# EAGLE design 4ch constant current driver (EAGLE 7.7.0)
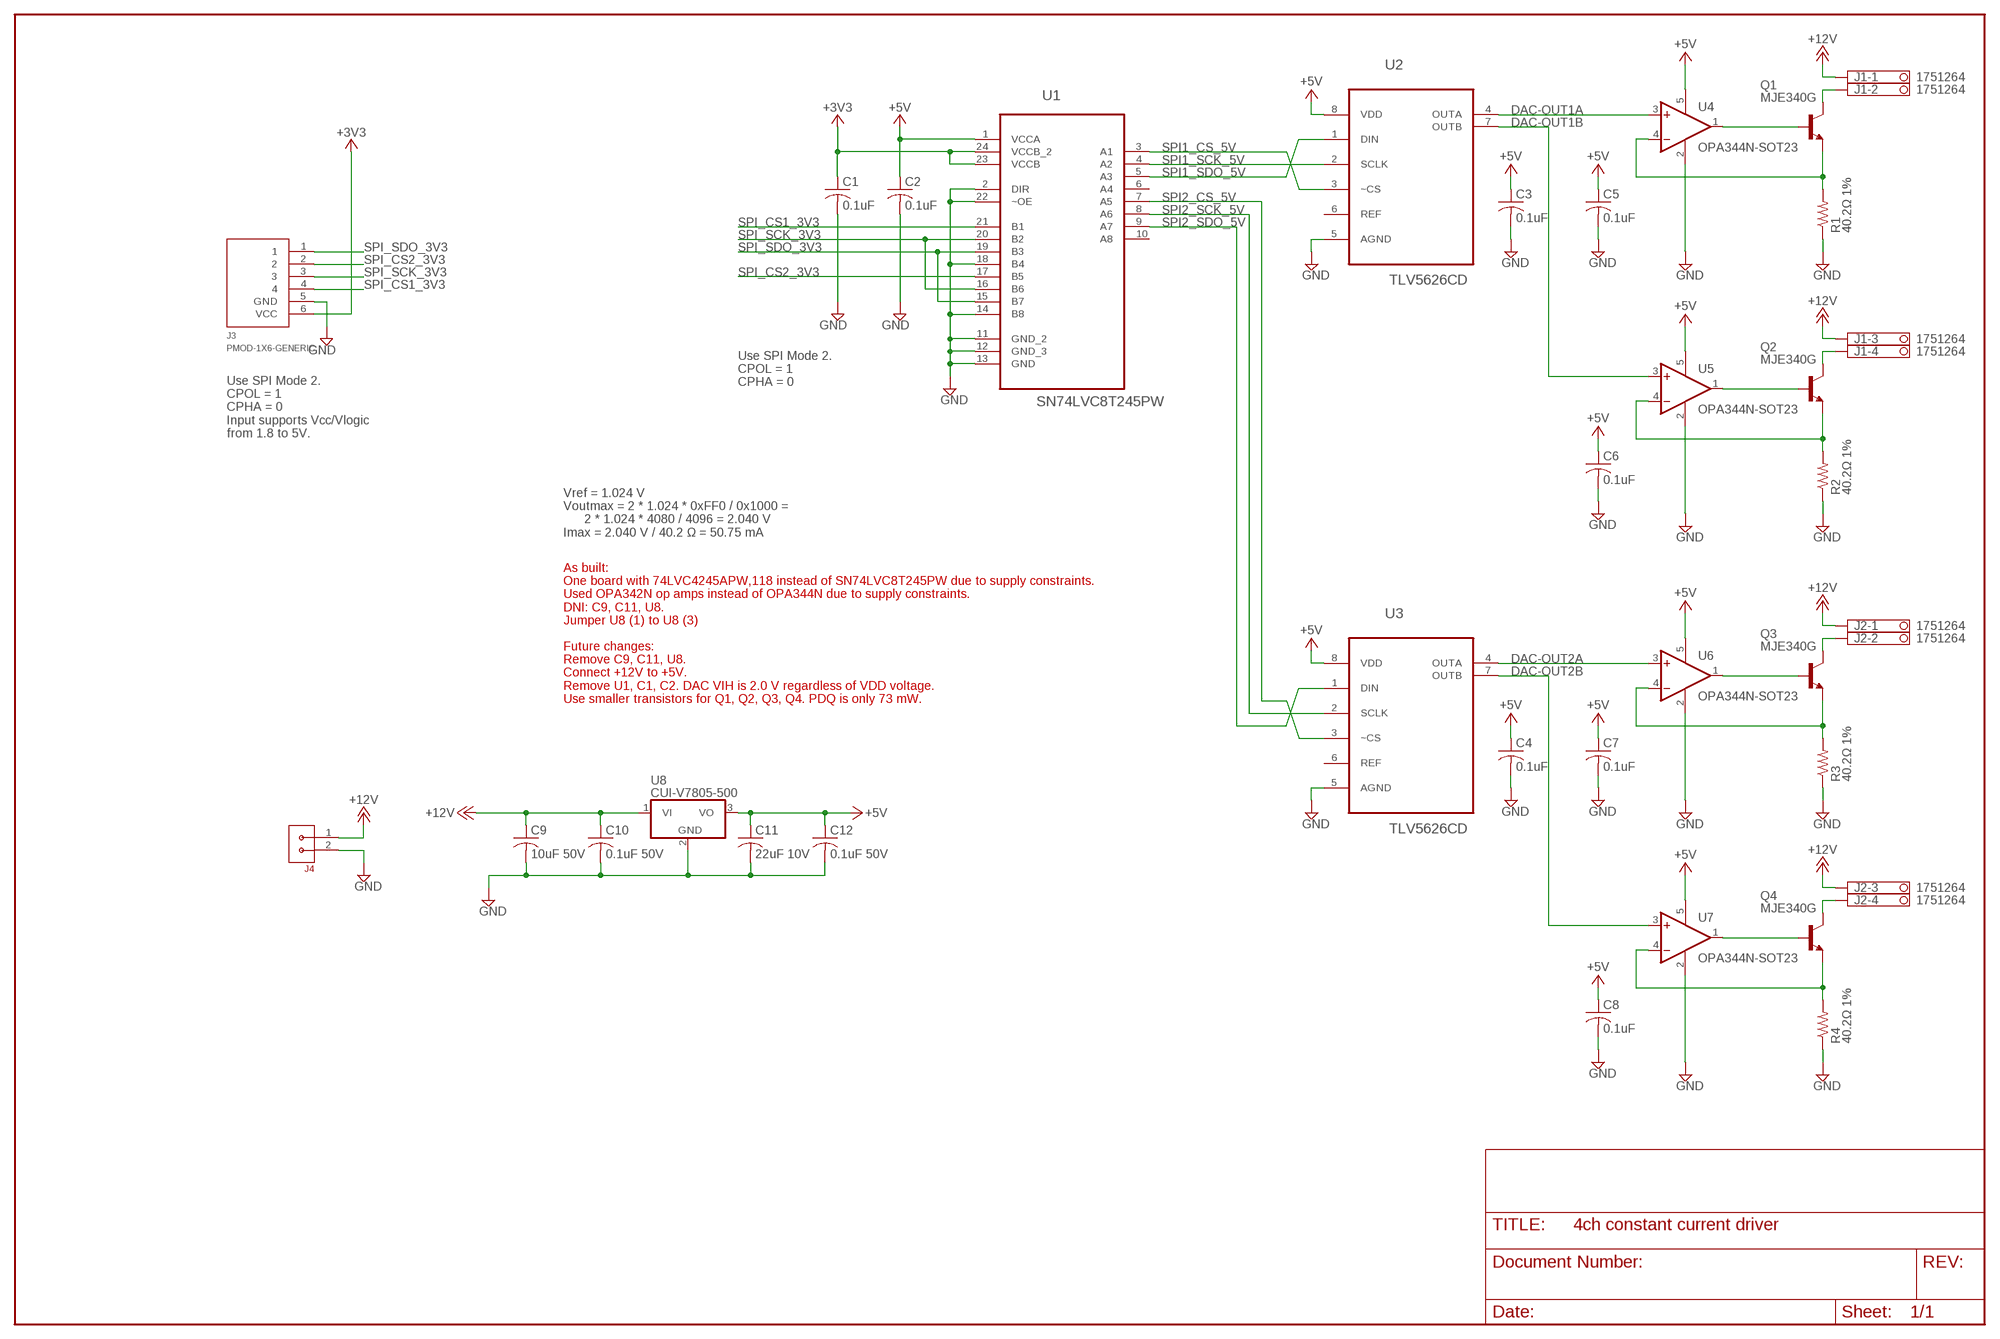
[diagram p0: schematic, sheet 1]

## Parts
C1  0.1uF  C-USC0603K  [C0603K]
C2  0.1uF  C-USC0603K  [C0603K]
C3  0.1uF  C-USC0603K  [C0603K]
C4  0.1uF  C-USC0603K  [C0603K]
C5  0.1uF  C-USC0603K  [C0603K]
C6  0.1uF  C-USC0603K  [C0603K]
C7  0.1uF  C-USC0603K  [C0603K]
C8  0.1uF  C-USC0603K  [C0603K]
C9  10uF 50V  C-USC1210K  [C1210K]
C10  0.1uF 50V  C-USC1206K  [C1206K]
C11  22uF 10V  C-USC1206K  [C1206K]
C12  0.1uF 50V  C-USC1206K  [C1206K]
J1  1751264  [1751264]
J2  1751264  [1751264]
J3  PMOD-1X6-GENERIC  [CON-PMOD-1X6]
J4  CON-3.81MM-1X2-PHOENIX  [CON-PHOENIX-3.81-1X2-RA]
Q1  MJE340G  -NPN-TO126V  [TO126V]
Q2  MJE340G  -NPN-TO126V  [TO126V]
Q3  MJE340G  -NPN-TO126V  [TO126V]
Q4  MJE340G  -NPN-TO126V  [TO126V]
R1  40.2Ω 1%  R-US_R1210  [R1210]
R2  40.2Ω 1%  R-US_R1210  [R1210]
R3  40.2Ω 1%  R-US_R1210  [R1210]
R4  40.2Ω 1%  R-US_R1210  [R1210]
U1  SN74LVC8T245PW  SN74AVC8T245PW  [SOP65P640X120-24N]
U2  TLV5626CD  [SOIC127P600X175-8N]
U3  TLV5626CD  [SOIC127P600X175-8N]
U4  OPA344N-SOT23  [SOT23-5]
U5  OPA344N-SOT23  [SOT23-5]
U6  OPA344N-SOT23  [SOT23-5]
U7  OPA344N-SOT23  [SOT23-5]
U8  CUI-V7805-500  CUI-V7803-500  [CUI-78XX-500]

## Nets
+3V3: C1.1 J3.6(VCC) U1.23(VCCB) U1.24(VCCB_2)
+5V: C2.1 C3.1 C4.1 C5.1 C6.1 C7.1 C8.1 C11.1 C12.1 U1.1(VCCA) U2.8(VDD) U3.8(VDD) U4.5(V+) U5.5(V+) U6.5(V+) U7.5(V+) U8.3(VO)
+12V: C9.1 C10.1 J1.1 J1.3 J2.1 J2.3 J4.1 U8.1(VI)
DAC-OUT1A: U2.4(OUTA) U4.3(+IN)
DAC-OUT1B: U2.7(OUTB) U5.3(+IN)
DAC-OUT2A: U3.4(OUTA) U6.3(+IN)
DAC-OUT2B: U3.7(OUTB) U7.3(+IN)
GND: C1.2 C2.2 C3.2 C4.2 C5.2 C6.2 C7.2 C8.2 C9.2 C10.2 C11.2 C12.2 J3.5(GND) J4.2 R1.1 R2.1 R3.1 R4.1 U1.2(DIR) U1.11(GND_2) U1.12(GND_3) U1.13(GND) U1.14(B8) U1.18(B4) U1.22(~OE) U2.5(AGND) U3.5(AGND) U4.2(V-) U5.2(V-) U6.2(V-) U7.2(V-) U8.2(GND)
N$1: Q1.1(E) R1.2 U4.4(-IN)
N$2: Q3.1(E) R3.2 U6.4(-IN)
N$3: Q1.3(B) U4.1(OUT)
N$4: Q3.3(B) U6.1(OUT)
N$5: Q4.1(E) R4.2 U7.4(-IN)
N$6: Q4.3(B) U7.1(OUT)
N$10: Q2.1(E) R2.2 U5.4(-IN)
N$12: Q2.3(B) U5.1(OUT)
OUT1A: J1.2 Q1.2(C)
OUT1B: J1.4 Q2.2(C)
OUT2A: J2.2 Q3.2(C)
OUT2B: J2.4 Q4.2(C)
SPI1_CS_5V: U1.3(A1) U2.3(~CS)
SPI1_SCK_5V: U1.4(A2) U2.2(SCLK)
SPI1_SDO_5V: U1.5(A3) U2.1(DIN)
SPI2_CS_5V: U1.7(A5) U3.3(~CS)
SPI2_SCK_5V: U1.8(A6) U3.2(SCLK)
SPI2_SDO_5V: U1.9(A7) U3.1(DIN)
SPI_CS1_3V3: J3.4 U1.21(B1)
SPI_CS2_3V3: J3.2 U1.17(B5)
SPI_SCK_3V3: J3.3 U1.16(B6) U1.20(B2)
SPI_SDO_3V3: J3.1 U1.15(B7) U1.19(B3)
Unconnected: U1.6(A4) U1.10(A8) U2.6(REF) U3.6(REF)

## Notes on the sheet
- Use SPI Mode 2.
  CPOL = 1
  CPHA = 0
- Use SPI Mode 2.
  CPOL = 1
  CPHA = 0
  Input supports Vcc/Vlogic
  from 1.8 to 5V.
- Vref = 1.024 V
  Voutmax = 2 * 1.024 * 0xFF0 / 0x1000 = 
        2 * 1.024 * 4080 / 4096 = 2.040 V
  Imax = 2.040 V / 40.2 Ω = 50.75 mA
- As built:
  One board with 74LVC4245APW,118 instead of SN74LVC8T245PW due to supply constraints.
  Used OPA342N op amps instead of OPA344N due to supply constraints.
  DNI: C9, C11, U8.
  Jumper U8 (1) to U8 (3)
  
  Future changes:
  Remove C9, C11, U8.
  Connect +12V to +5V.
  Remove U1, C1, C2. DAC VIH is 2.0 V regardless of VDD voltage.
  Use smaller transistors for Q1, Q2, Q3, Q4. PDQ is only 73 mW.

## Library data of the parts
C1-C8 = rcl:C-US: CAPACITOR, American symbol; MFR: KEMET; MFR_PART_NO: C1206C104K5RACAUTO
C9 = rcl:C-US: CAPACITOR, American symbol; MFR: KEMET; MFR_PART_NO: C1210C106K5RACTU
C10 C12 = rcl:C-US: CAPACITOR, American symbol; MFR: KEMET; MFR_PART_NO: C1206S104M5RACTU
C11 = rcl:C-US: CAPACITOR, American symbol; MFR: KEMET; MFR_PART_NO: C1206C226K8RAC7800
J1 J2 = con-phoenix-350:1751264: MKDS 1/ 4-3,5 Printklemme Nennstrom: 10 A Bemessungsspannung: 160 V Raster: 3,5 mm Polzahl: 4 Montageart: Löten Anschlussart: Schraubanschluss Anschlussrichtung vom Leiter zur Platine: 0° Source: http://eshop.phoenixcontact.com .. 1751264.pdf; MPN: 1751264; OC_FARNELL: unknown; OC_NEWARK: 10R0934
J3 = 0GlenConnectors:PMOD-1X6-GENERIC
J4 = 0GlenConnectors:CON-3.81MM-1X2-PHOENIX
Q1-Q4 = transistor:*-NPN-: NPN Transistror BF959 corrected 2008.03.06; MFR: ON SEMI; MFR_PART_NO: MJE340G
R1-R4 = rcl:R-US_: RESISTOR, American symbol; MFR: PANASONIC; MFR_PART_NO: ERJ-14NF73R2U
U1 = Texas Instruments_By_element14_Batch_1:SN74AVC8T245PW: TRANSCEIVER; MFR: TI; MFR_PART_NO: SN74LVC8T245PW; MPN: SN74AVC8T245PW; OC_FARNELL: 1053490; OC_NEWARK: 10J9626; PACKAGE: TSSOP-24; SUPPLIER: Texas Instruments
U2 U3 = Texas Instruments_By_element14_Batch_1:TLV5626CD: 2.7-V TO 5.5-V LOW-POWER DUAL 8-BIT DIGITAL-TO-ANALOG CONVERTER WITH INTERNAL REFERENCE AND POWER DOWN; MFR: TI; MFR_PART_NO: TLV5626CD; MPN: TLV5626CD; OC_FARNELL: 4512819; OC_NEWARK: 19C9016; PACKAGE: SOIC-8; SUPPLIER: Texas Instruments
U4-U7 = linear:OPA*-SOT23: Single Operational Amplifier Low Power, Single-Supply, Rail-To-Rail Operational Amplifier Source: http://focus.ti.com/lit/ds/symlink/opa2345.pdf; MFR: TI; MFR_PART_NO: OPA344NA/3K
U8 = GlenPartsLibrary:CUI-V7803-500

## Board
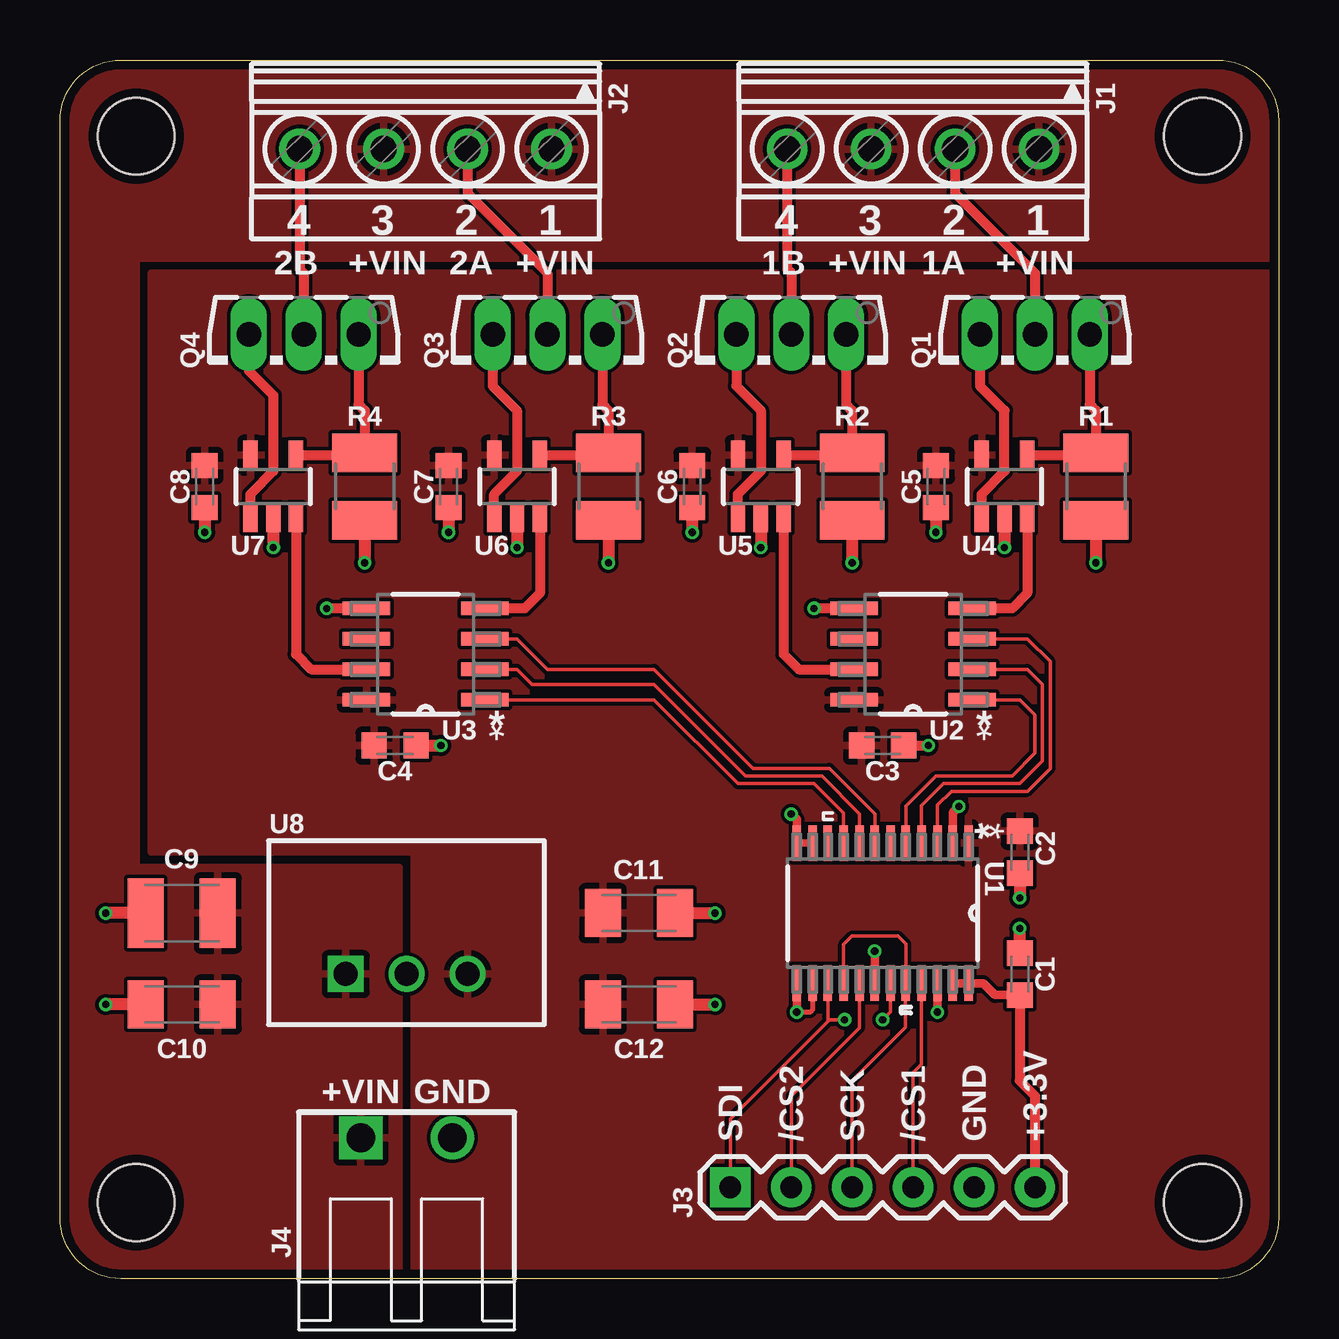
[diagram p1: board, top side]
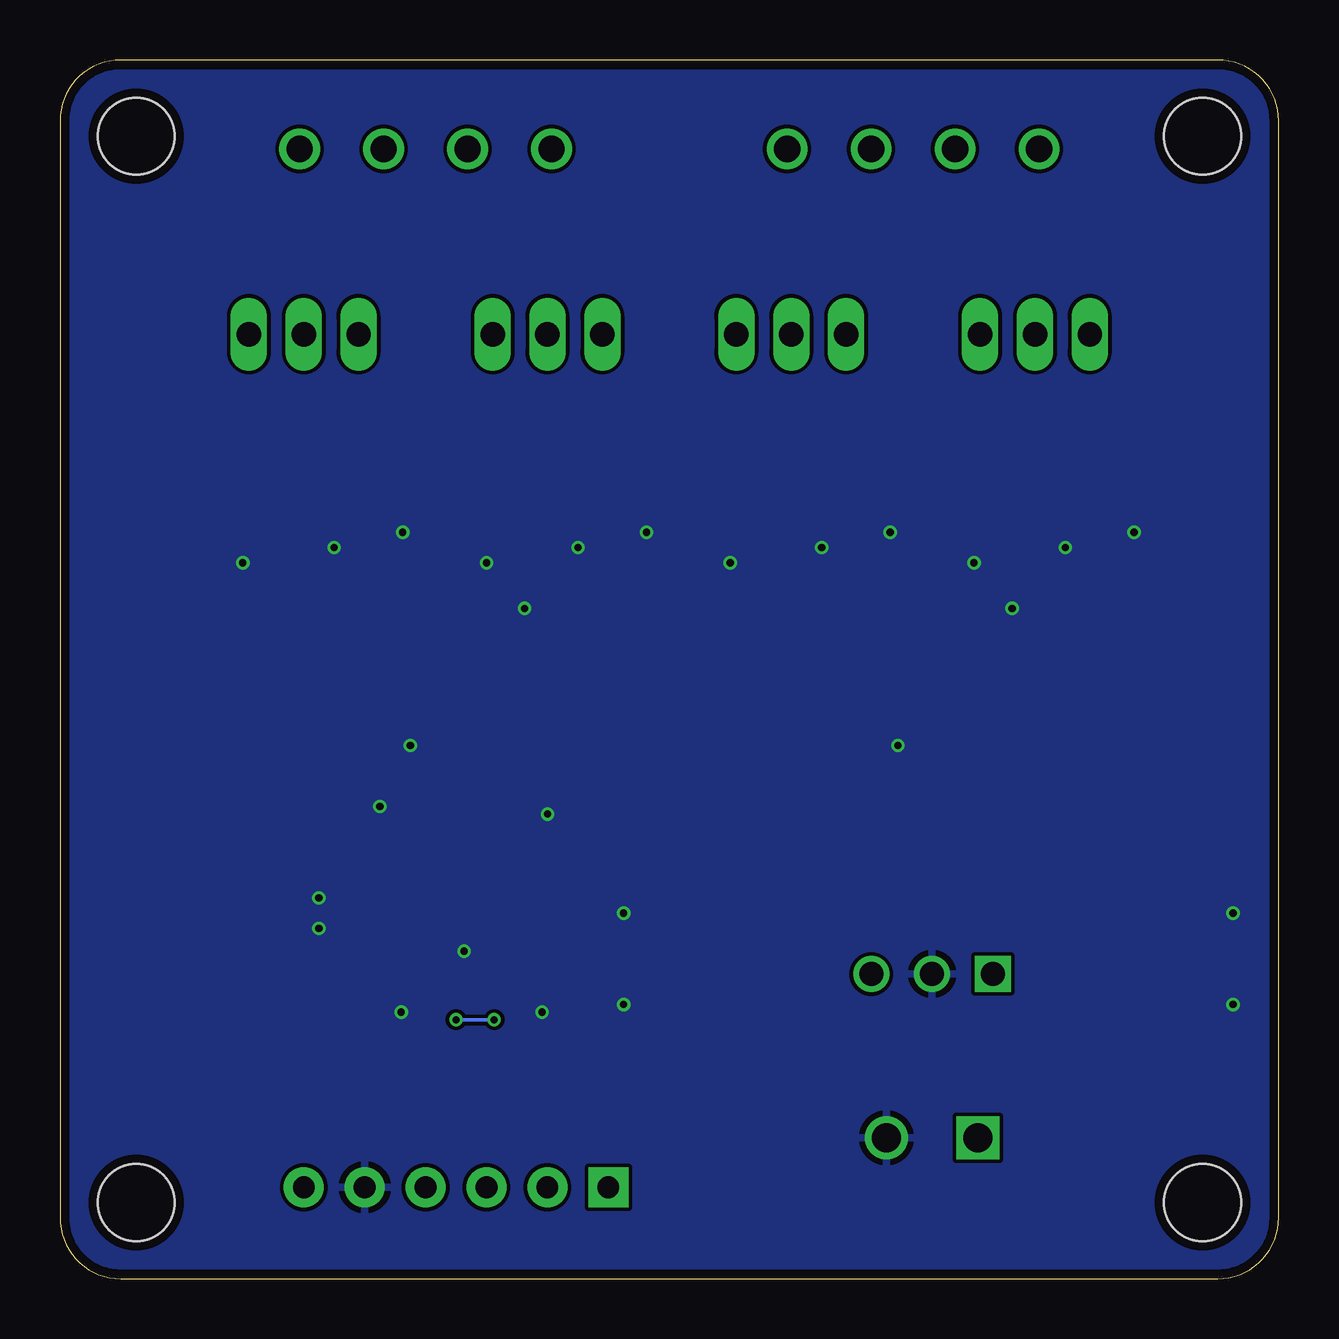
[diagram p2: board, bottom side, seen from below]

Size 50.8 x 50.8 mm. Coordinates in mm from the lower left corner, seen from the top.
Outline: 0,48.26 arc-90 2.54,50.8 48.26,50.8 arc-90 50.8,48.26 50.8,2.54 arc-90 48.26,0 2.54,0 arc-90 0,2.54 0,48.26
Copper layers (1*16): Top 0.035559375mm / dielectric 1.6mm / Bottom 0.035559375mm
Design rules "oshpark-2layer-2018": minimum track width 6mil, minimum drill 10mil, track to track 6mil, track to pad 6mil, pad to pad 6mil, via to via 6mil, smd to smd 6mil, copper to edge 15mil, drill to drill 6mil, minimum pad ring 5mil, minimum via ring 5mil, stop-mask expansion 2.5mil, vias tented up to drill 0mil, thermal gap 10mil
Holes 3.2 mm at 3.17,47.62 47.62,47.62 3.17,3.17 47.62,3.17

### Footprints (pad centres in the part's own frame; a part is rotated, then mirrored left to right if it is on the bottom)
C0603K = smd 1.05 x 1.08: 1 -0.875,0; 2 0.875,0
C1210K = smd 1.5 x 2.9: 1 -1.5,0; 2 1.5,0
C1206K = smd 1.5 x 2: 1 -1.5,0; 2 1.5,0
1751264 = drill 1.1 pad 1.7: 1 -5.25,-0.1; 2 -1.75,-0.1; 3 1.75,-0.1; 4 5.25,-0.1
CON-PMOD-1X6 = drill 0.9 pad 1.676 square: 1 0,6.35 | drill 0.9 pad 1.676: 2 0,3.81; 3 0,1.27; 4 0,-1.27; 5 0,-3.81; 6 0,-6.35
CON-PHOENIX-3.81-1X2-RA = drill 1.2 square: 1 0,0 | drill 1.2: 2 3.81,0
TO126V = drill 1.016 long: 1 -2.286,-1.27; 2 0,-1.27; 3 2.286,-1.27
R1210 = smd 1.6 x 2.7: 1 -1.4,0; 2 1.4,0
SOP65P640X120-24N = smd 1.473 x 0.356: 1 -2.921,3.581; 2 -2.921,2.921; 3 -2.921,2.286; 4 -2.921,1.626; 5 -2.921,0.965; 6 -2.921,0.33; 7 -2.921,-0.33; 8 -2.921,-0.965; 9 -2.921,-1.626; 10 -2.921,-2.286; 11 -2.921,-2.921; 12 -2.921,-3.581; 13 2.921,-3.581; 14 2.921,-2.921; 15 2.921,-2.286; 16 2.921,-1.626; 17 2.921,-0.965; 18 2.921,-0.33; 19 2.921,0.33; 20 2.921,0.965; 21 2.921,1.626; 22 2.921,2.286; 23 2.921,2.921; 24 2.921,3.581
SOIC127P600X175-8N = smd 1.981 x 0.559: 1 -2.464,1.905; 2 -2.464,0.635; 3 -2.464,-0.635; 4 -2.464,-1.905; 5 2.464,-1.905; 6 2.464,-0.635; 7 2.464,0.635; 8 2.464,1.905
SOT23-5 = smd 0.6 x 1.2: 1 -0.95,-1.306; 2 0,-1.306; 3 0.95,-1.306; 4 0.95,1.306; 5 -0.95,1.306
CUI-78XX-500 = drill 1 square: 1 0,0 | drill 1: 2 2.54,0; 3 5.08,0

### Placement (x,y rotation side)
C1  40.01,12.7 90 top
C2  40.01,17.78 270 top
C3  34.29,22.23 0 top
C4  13.97,22.23 0 top
C5  36.51,33.02 270 top
C6  26.35,33.02 270 top
C7  16.19,33.02 270 top
C8  6.03,33.02 270 top
C9  5.08,15.24 180 top
C10  5.08,11.43 180 top
C11  24.13,15.24 0 top
C12  24.13,11.43 0 top
J1  35.56,46.99 180 top
J2  15.24,46.99 180 top
J3  34.29,3.81 90 top
J4  12.54,5.87 0 top
Q1  40.64,38.1 180 top
Q2  30.48,38.1 180 top
Q3  20.32,38.1 180 top
Q4  10.16,38.1 180 top
R1  43.18,33.02 90 top
R2  33.02,33.02 90 top
R3  22.86,33.02 90 top
R4  12.7,33.02 90 top
U1  34.29,15.24 270 top
U2  35.56,26.04 180 top
U3  15.24,26.04 180 top
U4  39.37,33.02 0 top
U5  29.21,33.02 0 top
U6  19.05,33.02 0 top
U7  8.89,33.02 0 top
U8  11.91,12.7 0 top

### Tracks (layer width: path | path; a pad name or v marks a point on that pad's centre or on a via)
+3V3
  Top 0.356: U1.23 U1.24 38.48,12.32 38.98,11.82 C1.1
  Top 0.406: C1.1 40.01,8.26 40.64,7.62 J3.6
+5V
  pour Top (isolate 0.152): 3.81,41.91 50.8,41.91 50.8,0 14.76,0 14.76,17.78 3.81,17.78
+12V
  pour Top (isolate 0.152): 0,0 0,50.8 50.8,50.8 50.8,42.55 3.17,42.55 3.17,17.14 14.13,17.14 14.13,0
DAC-OUT1A
  Top 0.406: U4.3 40.32,28.57 39.69,27.94 U2.4
DAC-OUT1B
  Top 0.406: U5.3 30.16,26.04 30.8,25.4 U2.7
DAC-OUT2A
  Top 0.406: U6.3 20,28.57 19.37,27.94 U3.4
DAC-OUT2B
  Top 0.406: U7.3 9.84,26.04 10.48,25.4 U3.7
GND  (via drill 0.3)
  Top 0.203: U1.14 31.37,11.21 31.27,11.11 v30.71,11.11
  Top 0.305: U1.11 U1.12
  Top 0.356: U1.12 30.71,19.14 v30.48,19.37 | U1.13 v30.71,11.11 | U1.2 37.21,19.43 v37.47,19.68 | U1.22 v36.58,11.11 | U1.18 v33.96,13.65
  Top 0.406: C3.2 v36.2,22.23 | U3.5 v11.11,27.94 | U2.5 v31.43,27.94
  Top 0.508: U7.2 v8.89,30.48 | R4.1 v12.7,29.84 | R3.1 v22.86,29.84 | C8.2 v6.03,31.11 | U6.2 v19.05,30.48 | C7.2 v16.19,31.11 | R2.1 v33.02,29.84 | U5.2 v29.21,30.48 | C6.2 v26.35,31.11 | R1.1 v43.18,29.84 | U4.2 v39.37,30.48 | C5.2 v36.51,31.11 | C4.2 v15.88,22.23 | C2.2 v40.01,15.88 | C1.2 v40.01,14.61 | C9.2 v1.91,15.24 | C10.2 v1.91,11.43 | C11.2 v27.3,15.24 | C12.2 v27.3,11.43
  pour Bottom (isolate 0.152): 0,50.8 50.8,50.8 50.8,0 0,0
N$1
  Top 0.406: Q1.1 42.93,36.45 43.18,36.2 R1.2 43.09,34.33 U4.4
N$2
  Top 0.406: Q3.1 22.61,36.45 22.86,36.2 R3.2 22.77,34.33 U6.4
N$3
  Top 0.406: U4.1 38.42,32.7 39.37,33.66 39.37,36.2 38.35,37.21 Q1.3
N$4
  Top 0.406: Q3.3 18.03,37.21 19.05,36.2 19.05,33.66 18.1,32.7 U6.1
N$5
  Top 0.406: Q4.1 12.45,36.45 12.7,36.2 R4.2 12.61,34.33 U7.4
N$6
  Top 0.406: Q4.3 7.87,37.85 8.89,36.83 8.89,33.66 7.94,32.7 U7.1
N$10
  Top 0.406: Q2.1 32.77,36.45 33.02,36.2 R2.2 32.93,34.33 U5.4
N$12
  Top 0.406: Q2.3 28.19,37.21 29.21,36.2 29.21,33.66 28.26,32.7 U5.1
OUT1A
  Top 0.406: J1.2 37.31,45.24 40.64,41.91 Q1.2
OUT1B
  Top 0.406: J1.4 30.31,42.08 30.48,41.91 Q2.2
OUT2A
  Top 0.406: J2.2 16.99,45.24 20.32,41.91 Q3.2
OUT2B
  Top 0.406: J2.4 9.99,42.08 10.16,41.91 Q4.2
SPI1_CS_5V
  Top 0.152: U1.3 36.58,19.75 37.15,20.32 40.32,20.32 41.27,21.27 41.27,25.72 40.32,26.67 U2.3
SPI1_SCK_5V
  Top 0.152: U2.2 40.32,25.4 40.96,24.77 40.96,21.59 40.01,20.64 36.83,20.64 35.92,19.72 U1.4
SPI1_SDO_5V
  Top 0.152: U1.5 35.26,19.7 36.51,20.95 39.69,20.95 40.64,21.91 40.64,23.5 40.01,24.13 U2.1
SPI2_CS_5V
  Top 0.152: U3.3 19.05,26.67 20.32,25.4 24.77,25.4 28.89,21.27 32.07,21.27 33.96,19.38 U1.7
SPI2_SCK_5V
  Top 0.152: U3.2 19.05,25.4 19.68,24.77 24.77,24.77 28.57,20.95 31.75,20.95 33.33,19.38 U1.8
SPI2_SDO_5V
  Top 0.152: U3.1 24.77,24.13 28.26,20.64 31.43,20.64 32.66,19.41 U1.9
SPI_CS1_3V3
  Top 0.152: U1.21 35.92,8.93 35.56,8.57 J3.4
SPI_CS2_3V3
  Top 0.152: U1.17 33.33,10.46 30.48,7.62 J3.2
SPI_SCK_3V3
  Top 0.152: U1.16 32.66,13.93 33.02,14.29 34.92,14.29 35.26,13.96 U1.20 35.24,12.31 35.24,10.48 33.02,8.26 J3.3
SPI_SDO_3V3  (via drill 0.3)
  Top 0.152: U1.15 32,10.79 | 32,10.79 32,10.73 27.94,6.67 J3.1 | U1.19 34.62,11.12 v34.29,10.79 | v32.7,10.79 32,10.79
  Bottom 0.152: v34.29,10.79 v32.7,10.79

### Text on the board
_tsilk: J2 | J1 | 4 | 3 | 2 | 1 | 4 | 3 | 2 | 1 | 2B | +VIN | 2A | +VIN | 1B | +VIN | 1A | +VIN | Q4 | Q3 | Q2 | Q1 | R4 | R3 | R2 | R1 | C8 | C7 | C6 | C5 | U7 | U6 | U5 | U4 | * | * | U3 | U2 | C4 | C3 | U8 | * | C2 | C9 | C11 | U1 | C1 | C10 | C12 | +VIN | GND | SDI | /CS2 | SCK | /CS1 | GND | +3.3V | J3 | J4